# EAGLE schematic Nusbio.FT232H (EAGLE 7.6.0)
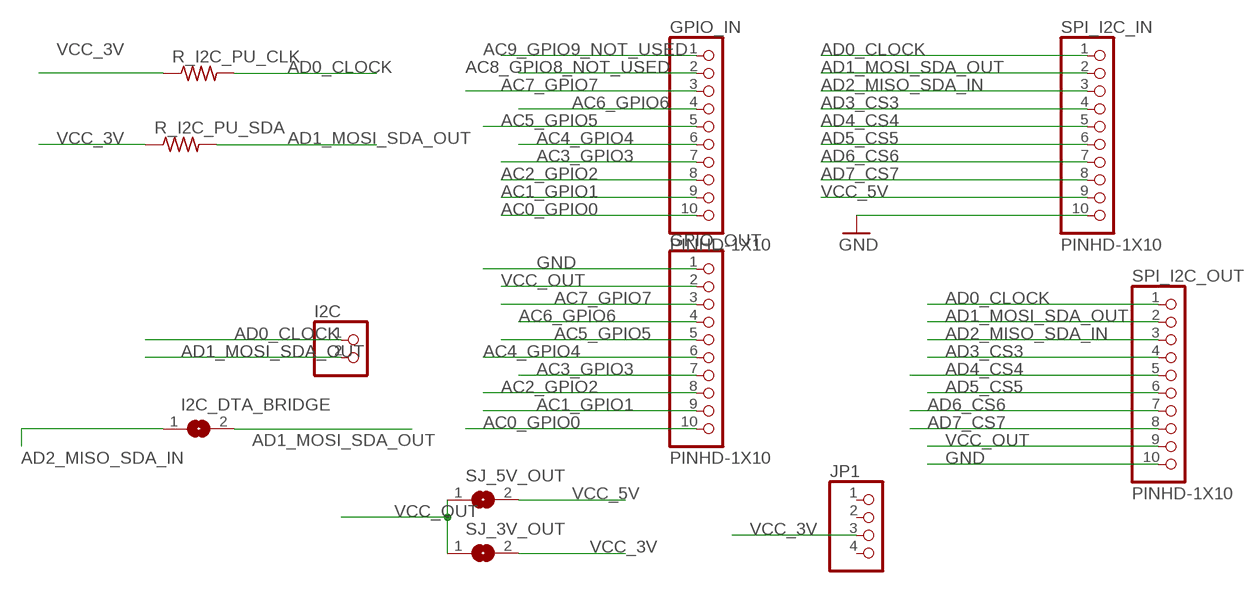
[diagram p0: schematic, sheet 1]

## Parts
GPIO_IN  PINHD-1X10  [1X10-BIG]
GPIO_OUT  PINHD-1X10  [1X10-BIG]
I2C  PINHD-1X2  [1X02]
I2C_DTA_BRIDGE  SOLDERJUMPERREFLOW  [SOLDERJUMPER_REFLOW]
JP1  PINHD-1X4  [1X04]
R_I2C_PU_CLK  R-US_R1206  [R1206]
R_I2C_PU_SDA  R-US_R1206  [R1206]
SJ_3V_OUT  SOLDERJUMPERREFLOW  [SOLDERJUMPER_REFLOW]
SJ_5V_OUT  SOLDERJUMPERREFLOW  [SOLDERJUMPER_REFLOW]
SPI_I2C_IN  PINHD-1X10  [1X10-BIG]
SPI_I2C_OUT  PINHD-1X10  [1X10-BIG]

## Nets
AC0_GPIO0: GPIO_IN.10 GPIO_OUT.10
AC1_GPIO1: GPIO_IN.9 GPIO_OUT.9
AC2_GPIO2: GPIO_IN.8 GPIO_OUT.8
AC3_GPIO3: GPIO_IN.7 GPIO_OUT.7
AC4_GPIO4: GPIO_IN.6 GPIO_OUT.6
AC5_GPIO5: GPIO_IN.5 GPIO_OUT.5
AC6_GPIO6: GPIO_IN.4 GPIO_OUT.4
AC7_GPIO7: GPIO_IN.3 GPIO_OUT.3
AC8_GPIO8_NOT_USED: GPIO_IN.2
AC9_GPIO9_NOT_USED: GPIO_IN.1
AD0_CLOCK: I2C.1 R_I2C_PU_CLK.2 SPI_I2C_IN.1 SPI_I2C_OUT.1
AD1_MOSI_SDA_OUT: I2C.2 I2C_DTA_BRIDGE.2 R_I2C_PU_SDA.2 SPI_I2C_IN.2 SPI_I2C_OUT.2
AD2_MISO_SDA_IN: I2C_DTA_BRIDGE.1 SPI_I2C_IN.3 SPI_I2C_OUT.3
AD3_CS3: SPI_I2C_IN.4 SPI_I2C_OUT.4
AD4_CS4: SPI_I2C_IN.5 SPI_I2C_OUT.5
AD5_CS5: SPI_I2C_IN.6 SPI_I2C_OUT.6
AD6_CS6: SPI_I2C_IN.7 SPI_I2C_OUT.7
AD7_CS7: SPI_I2C_IN.8 SPI_I2C_OUT.8
GND: GPIO_OUT.1 SPI_I2C_IN.10 SPI_I2C_OUT.10
VCC_3V: JP1.3 R_I2C_PU_CLK.1 R_I2C_PU_SDA.1 SJ_3V_OUT.2
VCC_5V: SJ_5V_OUT.2 SPI_I2C_IN.9
VCC_OUT: GPIO_OUT.2 SJ_3V_OUT.1 SJ_5V_OUT.1 SPI_I2C_OUT.9
Unconnected: JP1.1 JP1.2 JP1.4

## Library data of the parts
GPIO_IN GPIO_OUT SPI_I2C_IN SPI_I2C_OUT = adafruit:PINHD-1X10: Pin header 1x10 0.1" spacing With round pins
I2C = pinhead:PINHD-1X2: PIN HEADER
I2C_DTA_BRIDGE SJ_3V_OUT SJ_5V_OUT = microbuilder:SOLDERJUMPER: SMD Solder JUMPER Solder the two pads together to create a connection, or remove the solder to break it. REFLOW - Use this footprint for solder paste and reflow ovens. WAVE - Use this footprint for hand-soldering (larger pads). CLOSED - Has a trace between the two pads to ensure it is closed by default. The trace needs to be cut to disable the jumper, and can be closed again by creating a solder bridge between the two pads.
JP1 = pinhead:PINHD-1X4: PIN HEADER
R_I2C_PU_CLK R_I2C_PU_SDA = adafruit:R-US_: RESISTOR, American symbol